# Altium schematic sheet ADLX362.SchDoc: Acelerómetro
size A4; CompanyName: MUISE; Engineer: Manuel Viqueira Rodríguez; Organization: ETSI Telecomunicaciones; Address1: Av. Complutense, 30; Address2: , 28040 Madrid; Address3: Madrid; Address4: España; DocumentNumber: 7; Revision: V1.0; SheetNumber: 7; SheetTotal: 8; Engineer2: Marcos Vazquez Nuñez
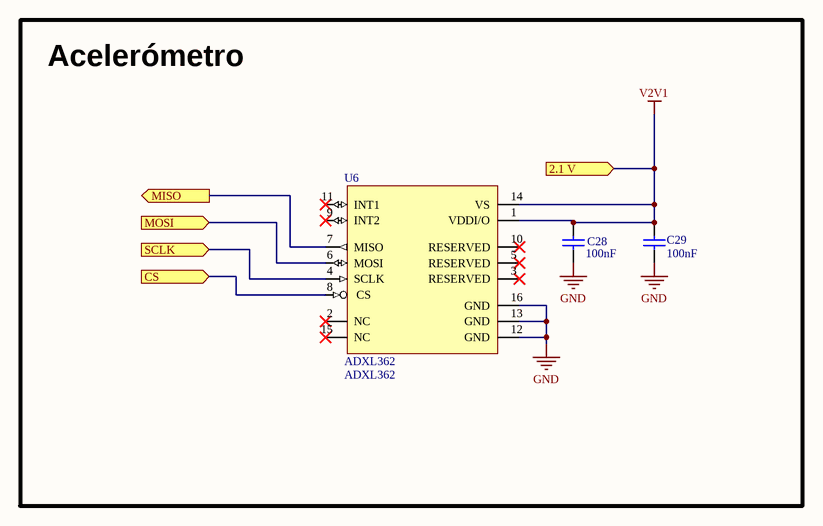
[diagram p0: ADLX362.SchDoc]

## Parts
C28  100nF  [CAPC1005X55X25ML05T10]
C29  100nF  [CAPC1005X55X25ML05T10]
U6  ADXL362  [ADXL362 - duplicate]

## Blocks framed on the sheet
Acelerómetro: C28 C29 U6

## Ports
2.1 V (in), CS (in), MISO (out), MOSI (in), SCLK (in)

## Nets
GND: C28.1 C29.1 U6.12(GND) U6.13(GND) U6.16(GND)
V2V1: C28.2 C29.2 U6.1(VDDI/O) U6.14(VS) ; port 2.1 V
CS: U6.8(CS) ; port CS
MISO: U6.7(MISO) ; port MISO
MOSI: U6.6(MOSI) ; port MOSI
SCLK: U6.4(SCLK) ; port SCLK

Not connected (* = marked no-connect by the designer): U6 2(NC)* 3(RESERVED)* 5(RESERVED)* 9(INT2)* 10(RESERVED)* 11(INT1)* 15(NC)*

## Notes on the sheet
- Size:
- Date:
- Title
- A4
- Number:
- Time:
- Revision:
- Sheet
- of
- Engineer
- File:

## Library data of the parts
C28 C29 = CMP-2008-04279-1: Manufacturer: Murata; Part Number: GRM1555C1H1R2BA01D